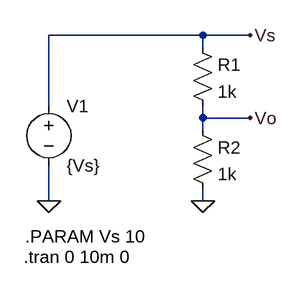
[diagram p0: schematic SimpleSource.asc]
SimpleSource.asc, the LTspice schematic file:
Version 4
SHEET 1 880 680
WIRE 288 16 80 16
WIRE 352 16 288 16
WIRE 288 32 288 16
WIRE 80 112 80 16
WIRE 288 128 288 112
WIRE 352 128 288 128
WIRE 288 144 288 128
WIRE 80 240 80 192
WIRE 288 240 288 224
FLAG 288 240 0
FLAG 80 240 0
FLAG 352 16 Vs
FLAG 352 128 Vo
SYMBOL voltage 80 96 R0
WINDOW 123 0 0 Left 0
WINDOW 39 0 0 Left 0
SYMATTR InstName V1
SYMATTR Value {Vs}
SYMBOL res 272 16 R0
SYMATTR InstName R1
SYMATTR Value 1k
SYMBOL res 272 128 R0
SYMATTR InstName R2
SYMATTR Value 1k
TEXT 48 288 Left 2 !.PARAM Vs 10
TEXT 46 316 Left 2 !.tran 0 10m 0

The netlist it stands for:
* SimpleSource.asc
V1 Vs 0 {Vs}
R1 Vs Vo 1k
R2 Vo 0 1k
.PARAM Vs 10
.tran 0 10m 0
.backanno
.end